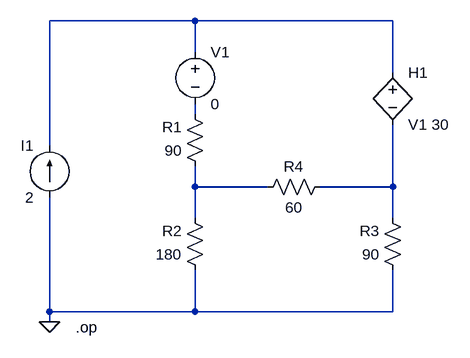
[diagram p0: schematic CH03-KP2-07.asc]
CH03-KP2-07.asc, the LTspice schematic file:
Version 4
SHEET 1 880 680
WIRE 208 112 -16 112
WIRE 512 112 208 112
WIRE 208 160 208 112
WIRE 512 192 512 112
WIRE 208 256 208 240
WIRE -16 304 -16 112
WIRE 208 368 208 336
WIRE 320 368 208 368
WIRE 512 368 512 272
WIRE 512 368 400 368
WIRE 208 416 208 368
WIRE 512 416 512 368
WIRE -16 560 -16 384
WIRE 208 560 208 496
WIRE 208 560 -16 560
WIRE 512 560 512 496
WIRE 512 560 208 560
WIRE -16 576 -16 560
FLAG -16 576 0
DATAFLAG 336 112 "$"
DATAFLAG 240 368 "$"
DATAFLAG 512 368 "$"
SYMBOL res 224 352 R180
WINDOW 0 36 76 Left 2
WINDOW 3 36 40 Left 2
SYMATTR InstName R1
SYMATTR Value 90
SYMBOL res 224 512 R180
WINDOW 0 36 76 Left 2
WINDOW 3 36 40 Left 2
SYMATTR InstName R2
SYMATTR Value 180
SYMBOL res 528 512 R180
WINDOW 0 36 76 Left 2
WINDOW 3 36 40 Left 2
SYMATTR InstName R3
SYMATTR Value 90
SYMBOL res 304 384 R270
WINDOW 0 32 56 VTop 2
WINDOW 3 0 56 VBottom 2
SYMATTR InstName R4
SYMATTR Value 60
SYMBOL voltage 208 144 R0
SYMATTR InstName V1
SYMATTR Value 0
SYMBOL current -16 384 R180
WINDOW 0 24 80 Left 2
WINDOW 3 24 0 Left 2
SYMATTR InstName I1
SYMATTR Value 2
SYMBOL h 512 176 R0
SYMATTR InstName H1
SYMATTR Value V1 30
TEXT 24 584 Left 2 !.op

The netlist it stands for:
* CH03-KP2-07.asc
R1 N003 N002 90
R2 0 N003 180
R3 0 N004 90
R4 N003 N004 60
V1 N001 N002 0
I1 0 N001 2
H1 N001 N004 V1 30
.op
.backanno
.end